# Altium schematic sheet Copy of Copy of Sheet1.SchDoc
size A4; SheetNumber: 1; SheetTotal: 1
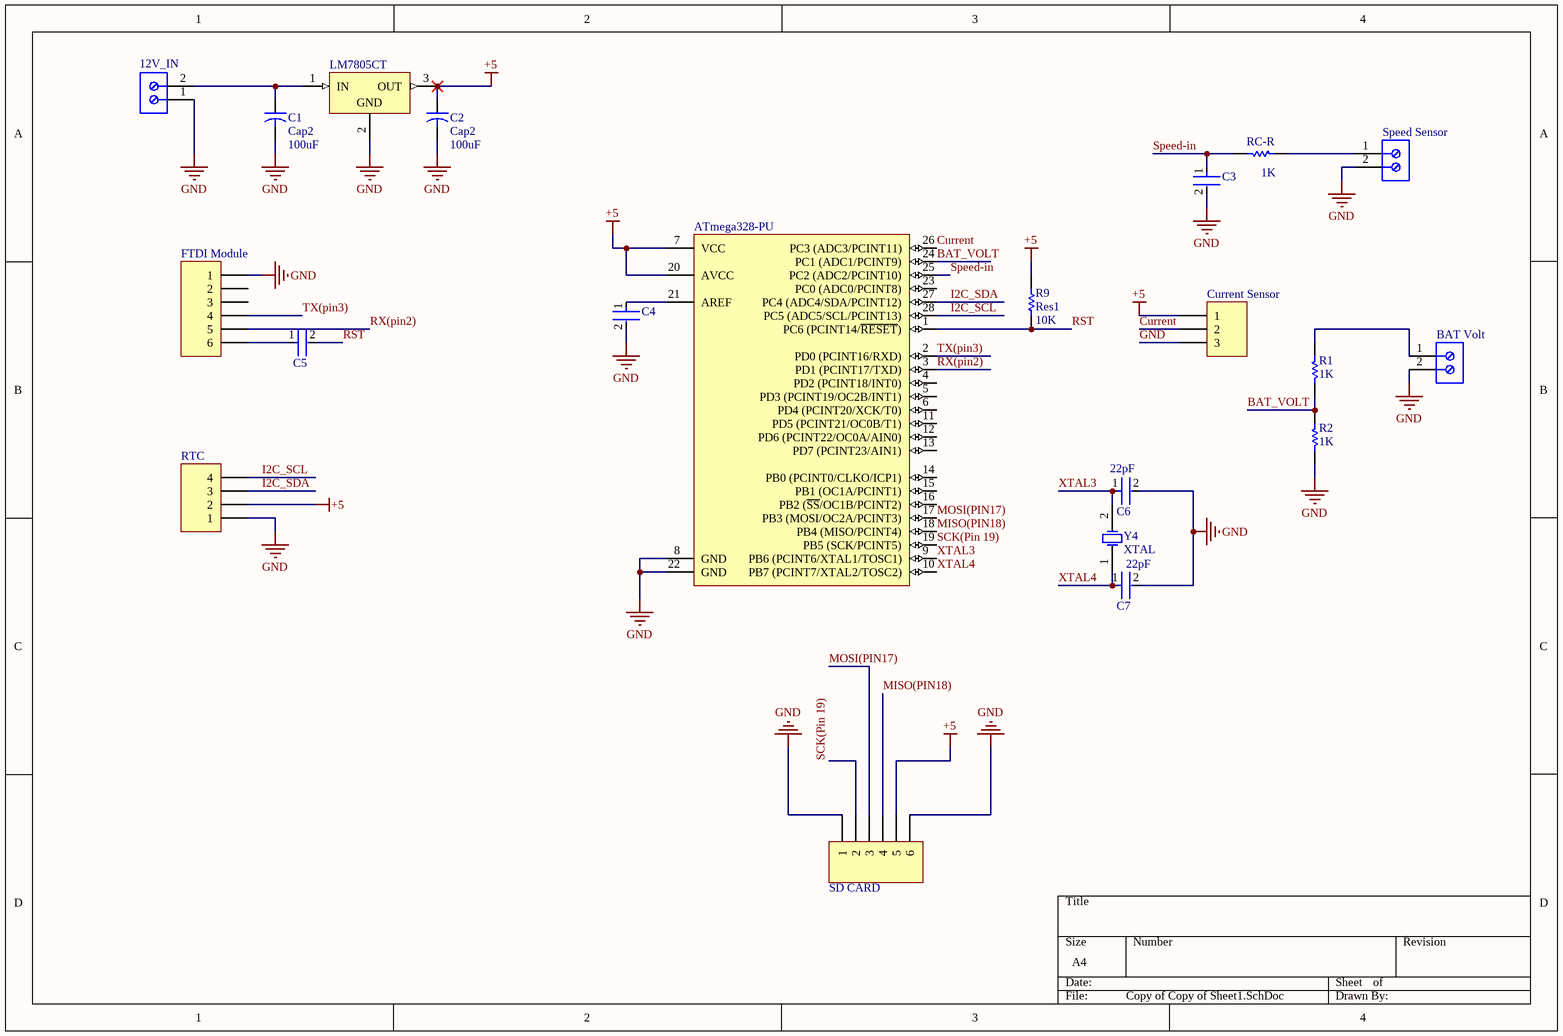
[diagram p0: Copy of Copy of Sheet1.SchDoc]

## Parts
12V_IN  691213710002  [691213710002]  (value not drawn)
ATmega328-PU  ATmega328-PU  [28P3]  (value not drawn)
BAT_Volt  691213710002  [691213710002]  (value not drawn)
C1  Cap2  value 100uF  [CAPR5-4X5]
C2  Cap2  value 100uF  [CAPR5-4X5]
C3  100nF  [FP-K15H5-MFG]  (value not drawn)
C4  K104K15X7RF53H5  [FP-K15H5-MFG]  (value not drawn)
C5  K104K15X7RF53H5  [FP-K15H5-MFG]  (value not drawn)
C6  22pF  [FP-K15H5-MFG]
C7  22pF  [FP-K15H5-MFG]
Current_Sensor  Current Sensor  [HDR1X3]  (value not drawn)
FTDI_Module  FTDI Module  [HDR1X6]  (value not drawn)
LM7805CT  LM7805CT  [FAIR-TO-220-3]  (value not drawn)
R1  value 1K  [AXIAL-0.3]  (hidden comment: Res1)
R2  value 1K  [AXIAL-0.3]  (hidden comment: Res1)
R9  Res1  value 10K  [AXIAL-0.3]
RC-R  value 1K  [AXIAL-0.3]  (hidden comment: Res1)
RTC  Header 4  [HDR1X4]  (value not drawn)
SD_CARD  SD CARD  [HDR1X6]  (value not drawn)
Speed_Sensor  Speed Sensor  [691213710002]  (value not drawn)
Y4  XTAL  [R38]

## Nets
+5: ATmega328-PU.7(VCC) ATmega328-PU.20(AVCC) C2.1 Current_Sensor.1 LM7805CT.3(OUT) R9.1 RTC.2 SD_CARD.5
GND: 12V_IN.1 ATmega328-PU.8(GND) ATmega328-PU.22(GND) BAT_Volt.2 C1.2 C2.2 C3.2 C4.2 C6.2 C7.2 Current_Sensor.3 FTDI_Module.1 LM7805CT.2(GND) R2.2 RTC.1 SD_CARD.1 SD_CARD.6 Speed_Sensor.2
BAT_VOLT: ATmega328-PU.24(PC1_(ADC1/PCINT9)) R1.2 R2.1
Current: ATmega328-PU.26(PC3_(ADC3/PCINT11)) Current_Sensor.2
I2C_SCL: ATmega328-PU.28(PC5_(ADC5/SCL/PCINT13)) RTC.4
I2C_SDA: ATmega328-PU.27(PC4_(ADC4/SDA/PCINT12)) RTC.3
MISO(PIN18): ATmega328-PU.18(PB4_(MISO/PCINT4)) SD_CARD.4
MOSI(PIN17): ATmega328-PU.17(PB3_(MOSI/OC2A/PCINT3)) SD_CARD.3
RST: ATmega328-PU.1(PC6_(PCINT14/~{RESET})) C5.2 R9.2
RX(pin2): ATmega328-PU.3(PD1_(PCINT17/TXD)) FTDI_Module.5
SCK(Pin 19): ATmega328-PU.19(PB5_(SCK/PCINT5)) SD_CARD.2
Speed-in: ATmega328-PU.25(PC2_(ADC2/PCINT10)) C3.1 RC-R.2
TX(pin3): ATmega328-PU.2(PD0_(PCINT16/RXD)) FTDI_Module.4
XTAL3: ATmega328-PU.9(PB6_(PCINT6/XTAL1/TOSC1)) C6.1 Y4.2(OSC2)
XTAL4: ATmega328-PU.10(PB7_(PCINT7/XTAL2/TOSC2)) C7.1 Y4.1(OSC1)
Net12V_IN_2: 12V_IN.2 C1.1 LM7805CT.1(IN)
NetATmega328-PU_21: ATmega328-PU.21(AREF) C4.1
NetBAT_Volt_1: BAT_Volt.1 R1.1
NetC5_1: C5.1 FTDI_Module.6
NetRC-R_1: RC-R.1 Speed_Sensor.1

Not connected (* = marked no-connect by the designer): ATmega328-PU 4(PD2_(PCINT18/INT0)) 5(PD3_(PCINT19/OC2B/INT1)) 6(PD4_(PCINT20/XCK/T0)) 11(PD5_(PCINT21/OC0B/T1)) 12(PD6_(PCINT22/OC0A/AIN0)) 13(PD7_(PCINT23/AIN1)) 14(PB0_(PCINT0/CLKO/ICP1)) 15(PB1_(OC1A/PCINT1)) 16(PB2_(~{SS}/OC1B/PCINT2)) 23(PC0_(ADC0/PCINT8)); FTDI_Module 2 3

## Library data of the parts
12V_IN BAT_Volt Speed_Sensor = CMP-1502-02526-1: Serie 213 - 5.00 mm Horizontal Entry Modular with RisingCage Clamp WR-TBL, 2 pin; Manufacturer: Wurth Elektronik; Pin Number: 2; Pitch: 5.00mm; Packaging: Box; Datasheet URL: http://katalog.we-online.de/em/datasheet/6912137100xx.pdf; Mounting Technology: THT; Part Number: 691213710002; Operating Temperature: -40to105degC; Publisher: WurthElektronik; Manufacturer URL: http://www.we-online.de; Package Reference: 691213710002
ATmega328-PU = ATmega328-PU: 8-bit AVR Microcontroller, 32KB Flash, 1KB EEPROM, 2KB SRAM, 28-pin PDIP, Industrial Grade (-40°C to 85°C); DatasheetVersion: revD, May-2011; PackageVersion: revB, Sep-2001; PackageReference: 28P3; PackageDescription: 28-lead (0.300"/7.62mm Wide) Plastic Dual Inline Package (PDIP); ComponentLink1Description: Manufacturer URL; ComponentLink1URL: http://www.atmel.com/; ComponentLink2Description: ATmega48A/48PA/88A/88PA/168A/168PA/328/328P Datasheet; ComponentLink2URL: http://www.atmel.com/dyn/resources/prod_documents/8271.pdf; ComponentLink3Description: ATmega48A/48PA/88A/88PA/168A/168PA/328/328P Summary; ComponentLink3URL: http://www.atmel.com/dyn/resources/prod_documents/8271S.pdf
C1 C2 = Cap2: Capacitor; Published: 23-Sep-2002; PackageReference: CAPR5-4X5; Publisher: Altium Limited; PackageDescription: Capacitor; 2 Leads
C3 = CMP-02417-000048-1: CAP CER 0.1UF 50V X7R RADIAL; Tolerance: 10%; Lead/Base Style: Formed Leads; Lead Length: 30mm; Lead Diameter: 0.5mm; Radiation Hardening: No; Capacitance: 100nF; Lead Pitch: 5mm; Voltage: 50V; Mount: Through Hole; Package Quantity: 5000; Series: K; Case/Package: Dipped; Min Operating Temperature: -55°C; Depth: 2.5mm; Height - Seated (Max): 0.1inch; Voltage Rating (DC): 50V; Packaging: Bulk; RoHS Compliant: Yes; Construction: RADIAL; Thickness: 2.6mm; Max Operating Temperature: 125°C; Voltage Rating: 50V; Diameter: 500um; Dielectric: X7R; Width: 2.5mm; Length: 4mm; Weight: 0.005644oz; Termination: Radial; Height: 4mm
C4-C7 = CMP-02417-000048-1: CAP CER 0.1UF 50V X7R RADIAL; Capacitance: 100nF; Tolerance: 10%; Lead/Base Style: Formed Leads; Lead Length: 30mm; Lead Diameter: 0.5mm; Radiation Hardening: No; Lead Pitch: 5mm; Voltage: 50V; Mount: Through Hole; Package Quantity: 5000; Series: K; Case/Package: Dipped; Min Operating Temperature: -55°C; Depth: 2.5mm; Height - Seated (Max): 0.1inch; Voltage Rating (DC): 50V; Packaging: Bulk; RoHS Compliant: Yes; Construction: RADIAL; Thickness: 2.6mm; Max Operating Temperature: 125°C; Voltage Rating: 50V; Diameter: 500um; Dielectric: X7R; Width: 2.5mm; Length: 4mm; Weight: 0.005644oz; Termination: Radial; Height: 4mm
Current_Sensor = Header 3: Header, 3-Pin; LatestRevisionDate: 17-Jul-2002; LatestRevisionNote: Re-released for DXP Platform.; Publisher: Altium Limited
FTDI_Module SD_CARD = Header 6: Header, 6-Pin; LatestRevisionDate: 17-Jul-2002; LatestRevisionNote: Re-released for DXP Platform.; Publisher: Altium Limited
LM7805CT = CMP-2000-04938-1: Positive Voltage Regulator, 5 V, 1 A, -40 to 125 degC, 3-Pin TO-220, RoHS, Tube; Manufacturer: FairchildSemiconductor; Maximum Input Voltage: 35V; Maximum Quiescent Current: 8mA; Load Regulation: 100mV; Maximum Output Current: 2.2(Typ)A; Output Type: Fixed; Typical Dropout Voltage @ Current: 2@1AV; Rad Hard: No; Output Voltage: 5V; Accuracy: ±4%; Number of Outputs: 1; Category: LinearRegulator; Package Description: 3-Pin Through Hole Device, Body 10 x 4.5 mm, Pitch 2.54 mm; Packaging: Rail/Tube; Mounting: ThroughHole; Polarity: Positive; Manufacturer URL: https://www.fairchildsemi.com/; Line Regulation: 100mV; Datasheet Version: Aug-12; Datasheet URL: https://datasheet.ciiva.com/26904/lm7805ct-26904988.pdf; Package Reference: TO-220; Package URL: https://www.fairchildsemi.com/package-drawings/TO/TO220B03.pdf; Package: 3TO-220AB; Operating Temperature: -40to125degC; Type: Linear
R1 R2 R9 RC-R = Res1: Resistor; Published: 8-Jun-2000; LatestRevisionDate: 17-Jul-2002; LatestRevisionNote: Re-released for DXP Platform.; PackageReference: AXIAL-0.3; Publisher: Altium Limited; PackageDescription: Axial Device, Thru-Hole; 2 Leads; 0.3 in Pin Spacing
RTC = Header 4: Header, 4-Pin; LatestRevisionDate: 17-Jul-2002; LatestRevisionNote: Re-released for DXP Platform.; Publisher: Altium Limited
Y4 = XTAL: Crystal Oscillator; Published: 8-Jun-2000; LatestRevisionDate: 17-Jul-2002; LatestRevisionNote: Re-released for DXP Platform.; PackageReference: R38; Publisher: Altium Limited; PackageDescription: Crystal, Thru-Hole; 2 Leads; Body 3.1 x 8.2 mm (Dia.xH)